# Altium schematic sheet Schematic.SchDoc
size A
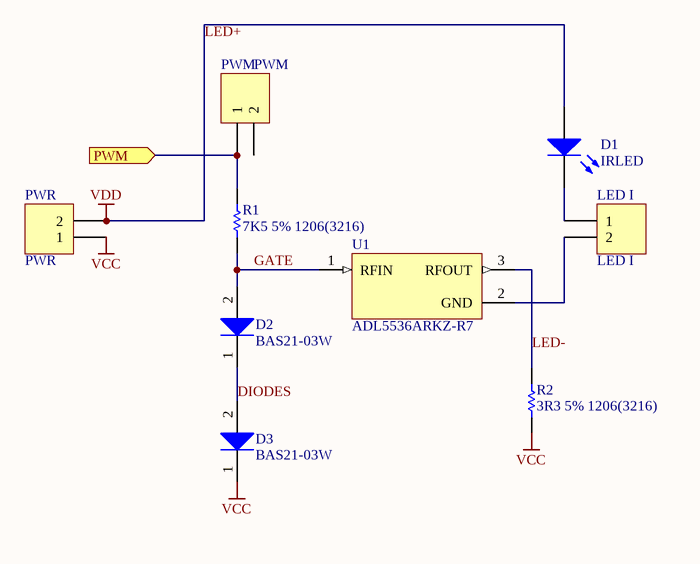
[diagram p0: Schematic.SchDoc]

## Parts
D1  IRLED  [LED-1]
D2  BAS21-03W  [INF-SOD323_V]
D3  BAS21-03W  [INF-SOD323_V]
LED_I  LED I  [HDR1X2]
PWM  PWM  [HDR1X2]
PWR  PWR  [HDR1X2]
R1  7K5 5% 1206(3216)  [RESC1206(3216)_L]
R2  3R3 5% 1206(3216)  [RESC1206(3216)_N]
U1  ADL5536ARKZ-R7  [ADI-RK-3_L]

## Ports
PWM (in)

## Nets
LED+: D1.1(A) PWR.2  [also labelled VDD]
VCC: D3.1(K) PWR.1 R2.1
DIODES: D2.1(K) D3.2(A)
GATE: D2.2(A) R1.1 U1.1(RFIN)
LED-: R2.2 U1.3(RFOUT)
PWM: PWM.1 R1.2 ; port PWM
NetD1_2: D1.2(K) LED_I.1
NetLED_I_2: LED_I.2 U1.2(GND)

Not connected (* = marked no-connect by the designer): PWM 2

## Library data of the parts
D1 = LED1: Typical RED GaAs LED; Published: 8-Jun-2000; LatestRevisionDate: 08-Jul-2005; LatestRevisionNote: Mech Layer 1 removed.; PackageReference: LED-1; Publisher: Altium Limited; PackageDescription: LED; 2 Leads
D2 D3 = CMP-1176-00009-1: Silicon Switching Diode, SOD323, Reel, Green; Manufacturer: Infineon; IF (max): 250Â mA; VBR (min): 250Â V; Green: TRUE; Configuration: Single; VR (max): 200Â V; IR (max): 100Â nA; VF (max): 1.25Â V; trr (max): 50Â ns; PackageReference: SOD323; ComponentLink3URL: http://www.infineon.com/dgdl/SOD323-Package_Overview.pdf?folderId=db3a30431936bc4b011952aab84f3bbe&fileId=db3a30431936bc4b011952beed653be3; ComponentLink1URL: http://www.infineon.com/; Mounting Technology: Surface Mount; ComponentLink3Description: Package Specification; ComponentLink2URL: http://www.infineon.com/dgdl/bas21series.pdf?folderId=db3a30431400ef6801141b5844e103ea&fileId=db3a30431400ef6801141bed353f040f; PartNumber: BAS21-03W; ComponentLink2Description: Datasheet; ComponentLink1Description: Manufacturer URL; PackageDescription: 2-Pin Small Outline Diode Package, 1.25 x 1.7 mm Body
LED_I PWM PWR = Header 2: Header, 2-Pin; LatestRevisionDate: 17-Jul-2002; LatestRevisionNote: Re-released for DXP Platform.; Publisher: Altium Limited
R1 = CMP-1014-00095-1: 7K5 0.25W 5% 1206 (3216 Metric)  SMD; Case-Metric: 3216; Case-EIA: 1206; Value: 7500.00 Ohm; Technology: SMT; Power: 0.25 W; Tolerance: 5 %
R2 = CMP-1014-00014-1: 3R3 0.25W 5% 1206 (3216 Metric)  SMD; Case-EIA: 1206; Case-Metric: 3216; Value: 3.30 Ohm; Power: 0.25 W; Tolerance: 5 %; Technology: SMT
U1 = CMP-0291-00032-1: 20 MHz to 1.0 GHz IF Gain Block, 5.5V, RK-3, 1000 Reel, Pb-Free; Min Pos Supply: 4.5V; Supply Current: 105mA; Noise Figure: 2.7dB; Frequency Range: 20 to 1000; 1 dB Comp Point: 19.7dBm; Gain: 19.4dB; Output IP3: 49dBm; ComponentLink2Description: Datasheet; ComponentLink3URL: http://www.analog.com/static/imported-files/packages/PKG_PDF/SOT-89(RK)/RK_3.pdf; PackageVersion: 121808-B; DatasheetVersion: Rev. 0; ComponentLink1URL: www.analog.com; ComponentLink3Description: Package Specification; ComponentLink2URL: http://www.analog.com/static/imported-files/data_sheets/ADL5536.pdf; PackageReference: RK-3; Code_JEDEC: TO-243; ComponentLink1Description: Manufacturer URL; PackageDescription: 3-Lead Small Outline Transistor Package [SOT-89]; Max Pos Supply: 5.5V